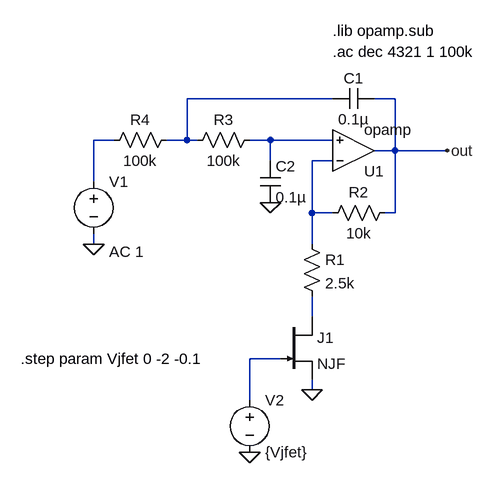
[diagram p0: schematic low-pass.asc]
low-pass.asc, the LTspice schematic file:
Version 4
SHEET 1 880 680
WIRE 112 80 -112 80
WIRE 208 80 176 80
WIRE -224 144 -256 144
WIRE -112 144 -112 80
WIRE -112 144 -144 144
WIRE -96 144 -112 144
WIRE 16 144 -16 144
WIRE 112 144 16 144
WIRE 208 160 208 80
WIRE 208 160 176 160
WIRE 288 160 208 160
WIRE 16 176 16 144
WIRE 112 176 80 176
WIRE -256 208 -256 144
WIRE 80 256 80 176
WIRE 112 256 80 256
WIRE 208 256 208 160
WIRE 208 256 192 256
WIRE -256 304 -256 288
WIRE 80 304 80 256
WIRE 80 416 80 384
WIRE 32 480 -16 480
WIRE 80 528 80 512
WIRE -16 544 -16 480
FLAG -256 304 0
FLAG 16 240 0
FLAG 288 160 out
FLAG -16 624 0
FLAG 80 528 0
SYMBOL Opamps\\opamp 144 224 M180
SYMATTR InstName U1
SYMBOL res 208 240 R90
WINDOW 0 0 56 VBottom 2
WINDOW 3 32 56 VTop 2
SYMATTR InstName R2
SYMATTR Value 10k
SYMBOL cap 176 64 R90
WINDOW 0 0 32 VBottom 2
WINDOW 3 32 32 VTop 2
SYMATTR InstName C1
SYMATTR Value 0.1µ
SYMBOL cap 0 176 R0
SYMATTR InstName C2
SYMATTR Value 0.1µ
SYMBOL res 0 128 R90
WINDOW 0 0 56 VBottom 2
WINDOW 3 32 56 VTop 2
SYMATTR InstName R3
SYMATTR Value 100k
SYMBOL res -128 128 R90
WINDOW 0 0 56 VBottom 2
WINDOW 3 32 56 VTop 2
SYMATTR InstName R4
SYMATTR Value 100k
SYMBOL voltage -256 192 R0
WINDOW 123 24 124 Left 2
WINDOW 39 0 0 Left 2
SYMATTR InstName V1
SYMATTR Value ""
SYMATTR Value2 AC 1
SYMBOL njf 32 416 R0
SYMATTR InstName J1
SYMBOL res 64 288 R0
SYMATTR InstName R1
SYMATTR Value 2.5k
SYMBOL voltage -16 528 R0
WINDOW 123 0 0 Left 2
WINDOW 39 0 0 Left 2
SYMATTR InstName V2
SYMATTR Value {Vjfet}
TEXT 112 -24 Left 2 !.lib opamp.sub
TEXT 112 8 Left 2 !.ac dec 4321 1 100k
TEXT -368 480 Left 2 !.step param Vjfet 0 -2 -0.1

The netlist it stands for:
* low-pass.asc
XU1 N004 N003 out opamp Aol=100K GBW=10Meg  ; pins invin noninvin out
R2 out N004 10k
C1 out N001 0.1µ
C2 N003 0 0.1µ
R3 N003 N001 100k
R4 N001 N002 100k
V1 N002 0 AC 1
J1 N005 N006 0 NJF
R1 N004 N005 2.5k
V2 N006 0 {Vjfet}
.model NJF NJF
.model PJF PJF
.lib standard.jft
.lib opamp.sub
.ac dec 4321 1 100k
.step param Vjfet 0 -2 -0.1
.backanno
.end